# EAGLE design proximity_switch_connector (EAGLE 9.4.2)
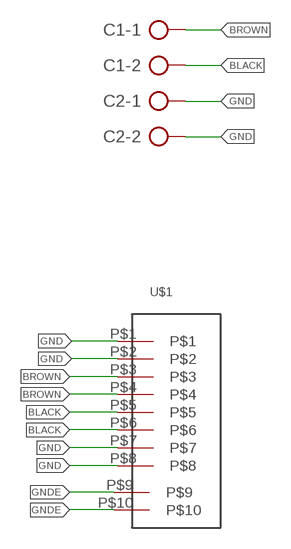
[diagram p0: schematic, sheet 1]

## Parts
C1  AK300/2  [AK300/2]
C2  AK300/2  [AK300/2]
U$1  RJ45_SMTRJ  [RJ45_SMT]

## Nets
BLACK: C1.2 U$1.P$5 U$1.P$6
BROWN: C1.1 U$1.P$3 U$1.P$4
GND: C2.1 C2.2 U$1.P$1 U$1.P$2 U$1.P$7 U$1.P$8
GNDE: U$1.P$9 U$1.P$10

## Library data of the parts
C1 C2 = 3D_MIG_Controller:AK300/2: CONNECTOR; OC_FARNELL: unknown; OC_NEWARK: unknown
U$1 = 3D_MIG_Controller:RJ45_SMT

## Board
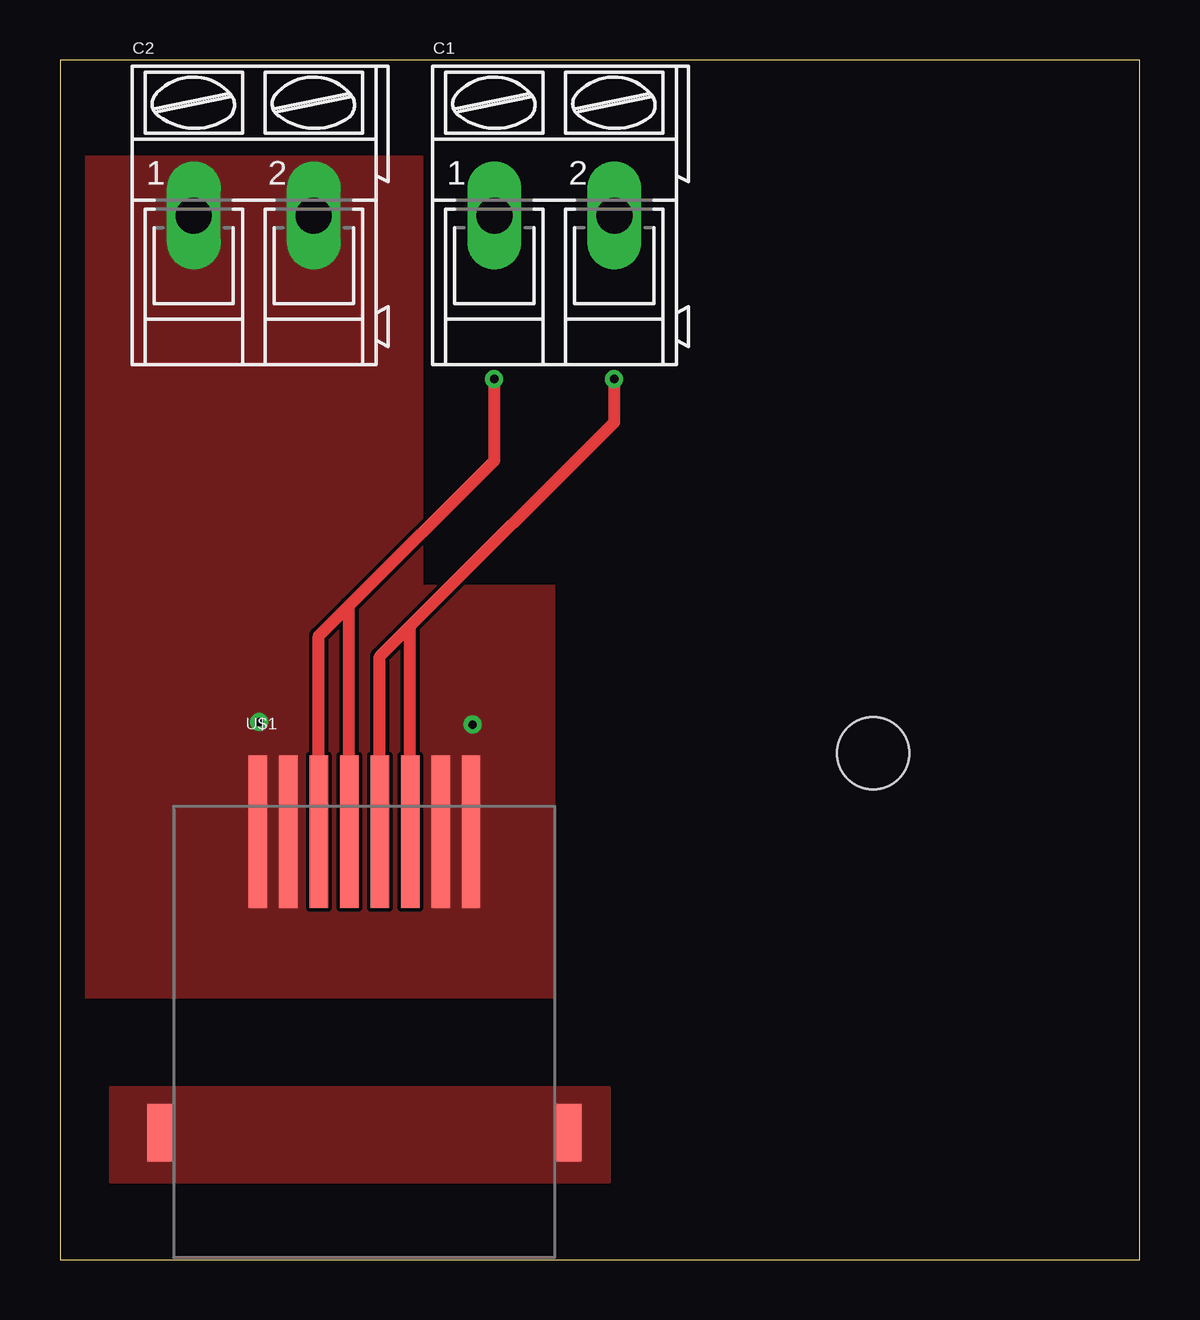
[diagram p1: board, top side]
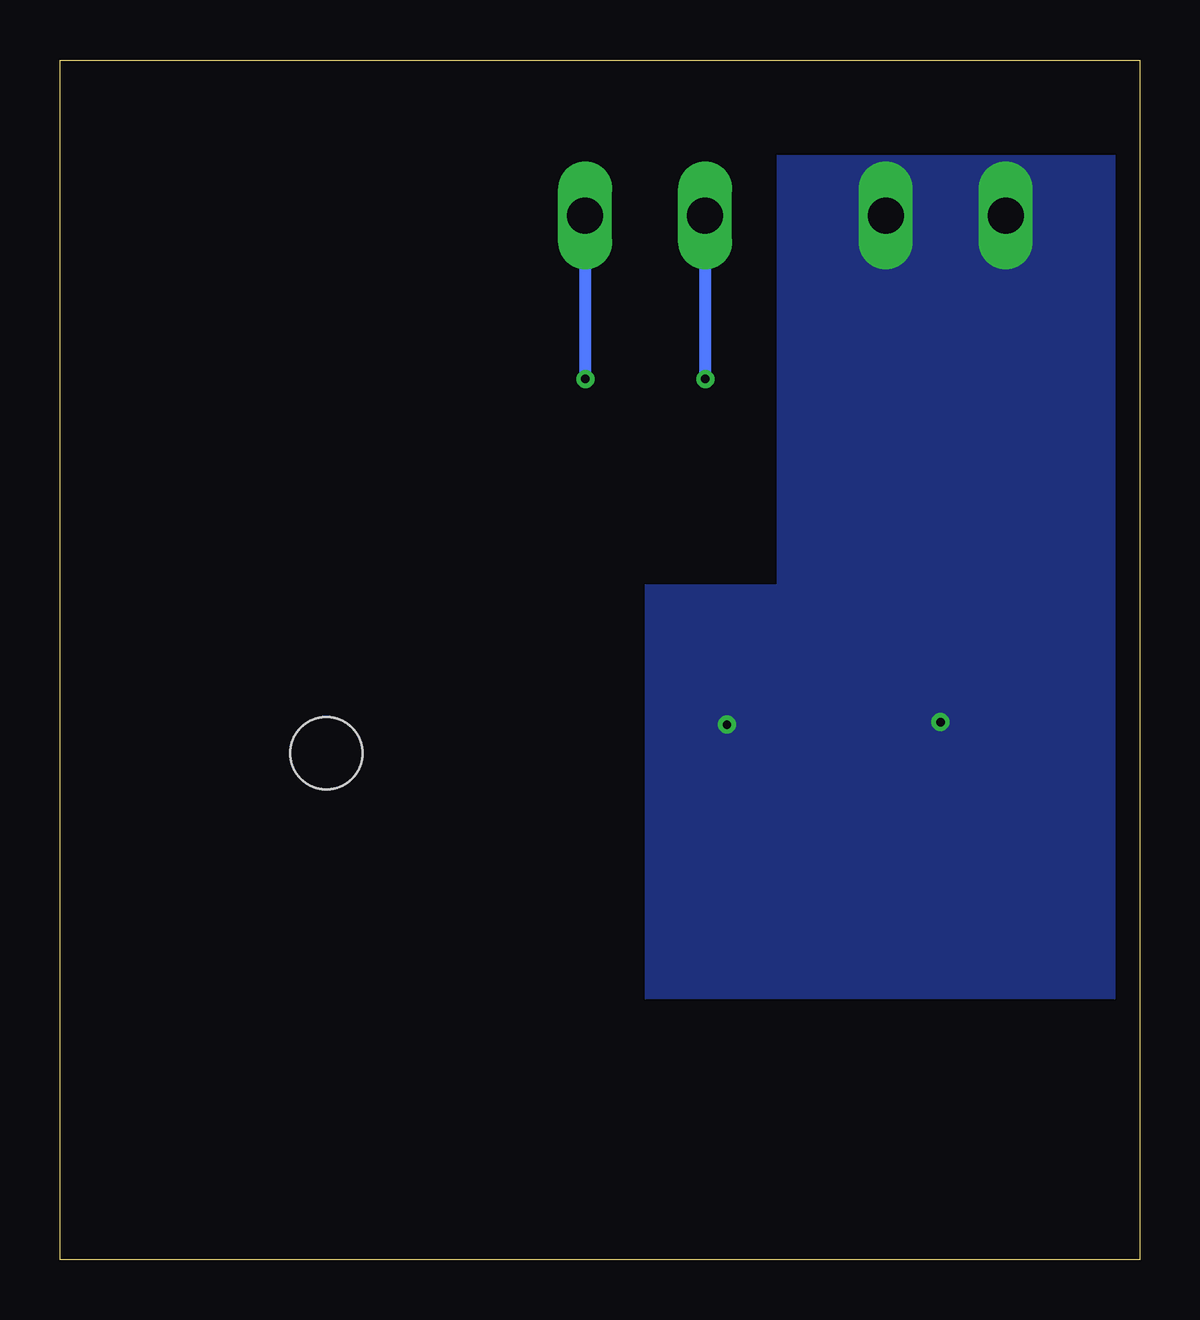
[diagram p2: board, bottom side, seen from below]

Size 45 x 50 mm. Coordinates in mm from the lower left corner, seen from the top.
Outline: 0,0 45,0 45,50 0,50 0,0
Copper layers (1*16): Top 0.035mm / dielectric 1.5mm / Bottom 0.035mm
Design rules "default": minimum track width 6mil, minimum drill 0.35mm, track to track 6mil, track to pad 6mil, pad to pad 6mil, via to via 6mil, smd to smd 6mil, copper to edge 40mil, drill to drill 6mil, minimum pad ring 10mil, minimum via ring 8mil, stop-mask expansion 4mil, vias tented up to drill 0mil, thermal gap 10mil
Holes 3 mm at 33.9,21.1

### Footprints (pad centres in the part's own frame; a part is rotated, then mirrored left to right if it is on the bottom)
AK300/2 = drill 1.5 long: 1 -2.515,0; 2 2.489,0
RJ45_SMT = smd 0.76 x 6.35: P$1 -3.18,8.94; P$2 -1.91,8.94; P$3 -0.64,8.94; P$4 0.63,8.94; P$5 1.9,8.94; P$6 3.17,8.94; P$7 4.44,8.94; P$8 5.71,8.94 | smd 1.1 x 2.4: P$9 -7.25,-3.6; P$10 9.75,-3.6

### Placement (x,y rotation side)
C1  20.62,43.52 0 top
C2  8.09,43.52 0 top
U$1  11.43,8.89 0 top

### Tracks (layer width: path | path; a pad name or v marks a point on that pad's centre or on a via)
BLACK  (via drill 0.35)
  Top 0.508: U$1.P$5 13.33,25.13 14.6,26.4 | 14.6,26.4 23.11,34.91 v23.11,36.69 v23.1,36.7 | U$1.P$6 14.6,26.4
  Bottom 0.508: v23.1,36.7 C1.2
BROWN  (via drill 0.35)
  Top 0.508: U$1.P$3 10.79,25.99 12.06,27.26 | U$1.P$4 12.06,27.26 | 12.06,27.26 18.11,33.3 v18.11,36.7 v18.1,36.7
  Bottom 0.508: v18.1,36.7 C1.1
GND  (via drill 0.35)
  other vias: 8.3,22.4 17.2,22.3
  pour Bottom (no thermals): 1,46 15.1,46 15.1,28.1 20.6,28.1 20.6,10.9 1,10.9
  pour Top (no thermals): 1,46 15.1,46 15.1,28.1 20.6,28.1 20.6,10.9 1,10.9
GNDE
  pour Top (no thermals): 2.1,7.2 22.9,7.2 22.9,3.2 2.1,3.2